# Altium schematic sheet STM32F1.SchDoc
size A3; Organization: Altium Limited; Address1: L3, 12a Rodborough Rd; Address2: Frenchs Forest; Address3: NSW; Address4: Australia 2086
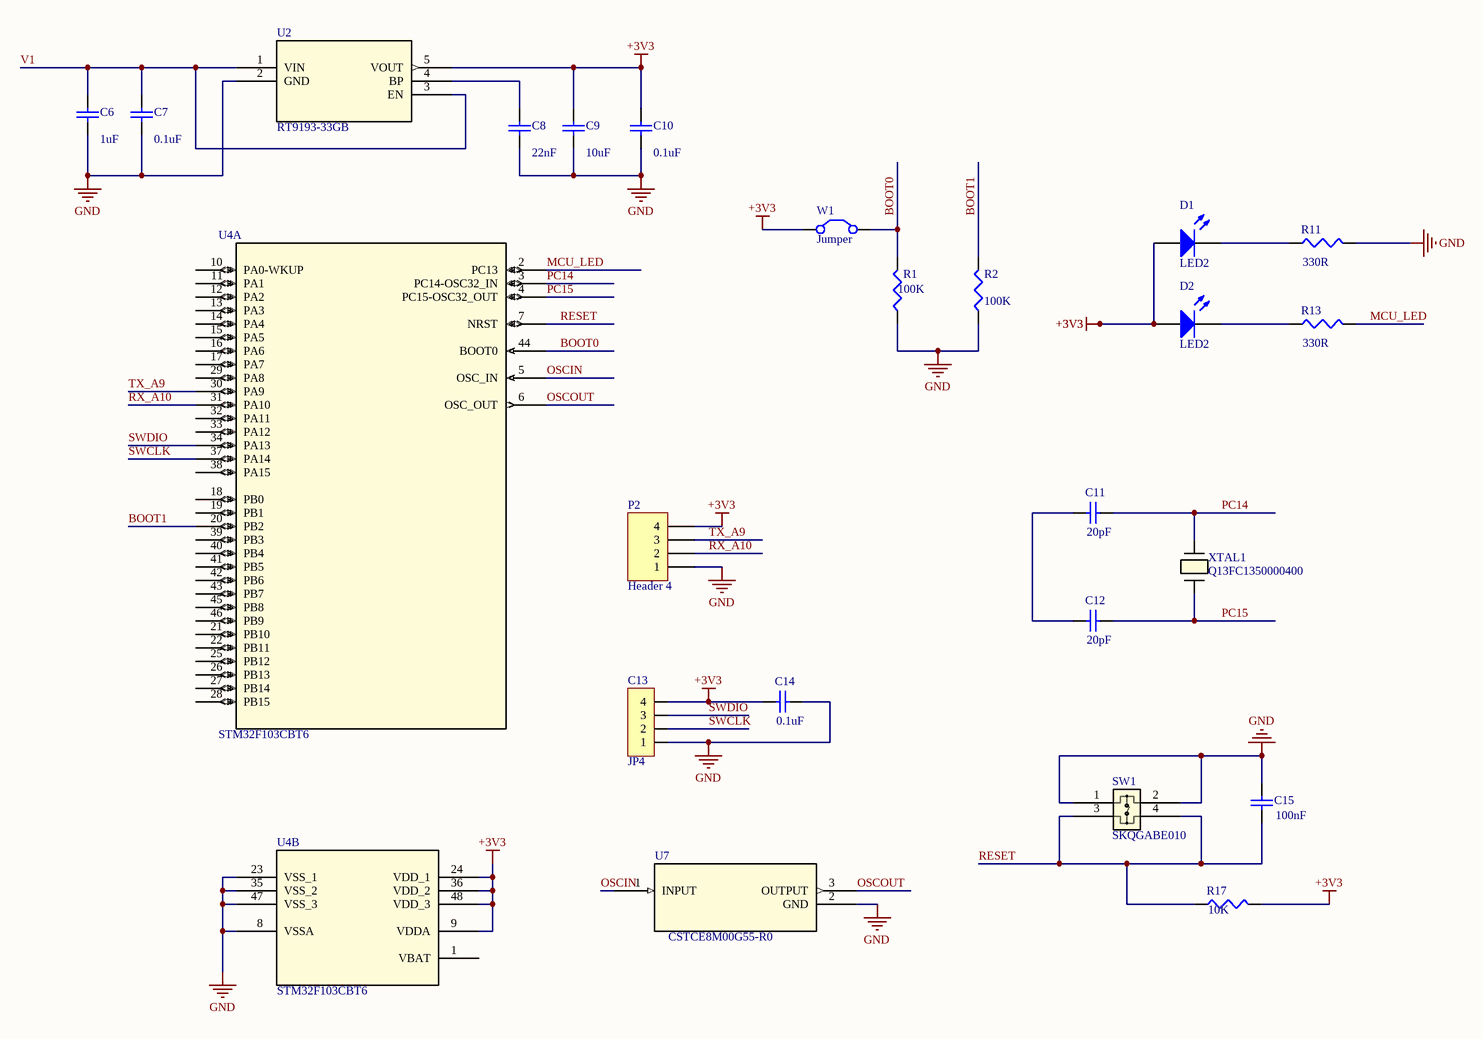
[diagram p0: STM32F1.SchDoc]

## Parts
C6  1uF  [RAD-0.3]
C7  0.1uF  [RAD-0.3]
C8  22nF  [RAD-0.3]
C9  10uF  [RAD-0.3]
C10  0.1uF  [RAD-0.3]
C11  20pF  [RAD-0.3]
C12  20pF  [RAD-0.3]
C13  JP4  [JP4-C1T]
C14  0.1uF  [RAD-0.3]
C15  100nF  [RAD-0.3]
D1  LED2  [3.2X1.6X1.1]
D2  LED2  [3.2X1.6X1.1]
P2  Header 4  [HDR1X4]
R1  100K  [J1-0603]
R2  100K  [J1-0603]
R11  330R  [J1-0603]
R13  330R  [J1-0603]
R17  10K  [J1-0603]
SW1  SKQGABE010  [SKQGABE010_ALPS]
U2  RT9193-33GB  [SOT-23-5_RIT]
U4  STM32F103CBT6  [LQFP48-7x7mm]  (parts A,B of 2)
U7  CSTCE8M00G55-R0  [CSTCE8M00G55-R0_MUR]
W1  Jumper  [RAD-0.2]
XTAL1  Q13FC1350000400  [XTAL_FC-135_EPS]

## Nets
+3V3: C9.2 C10.2 C13.4 C14.1 D1.1(A) D2.1(A) P2.4 R17.2 U2.5(VOUT) U4.9(VDDA) U4.24(VDD_1) U4.36(VDD_2) U4.48(VDD_3) W1.1(C1)
GND: C6.1 C7.1 C8.1 C9.1 C10.1 C13.1 C14.2 C15.1 P2.1 R1.1 R2.1 R11.2 SW1.1 SW1.2 U2.2(GND) U4.8(VSSA) U4.23(VSS_1) U4.35(VSS_2) U4.47(VSS_3) U7.2(GND)
BOOT0: R1.2 U4.44(BOOT0) W1.2(C2)
BOOT1: R2.2 U4.20(PB2)
MCU_LED: R13.2 U4.2(PC13)
OSCIN: U4.5(OSC_IN) U7.1(INPUT)
OSCOUT: U4.6(OSC_OUT) U7.3(OUTPUT)
PC14: C11.2 U4.3(PC14-OSC32_IN) XTAL1.2
PC15: C12.2 U4.4(PC15-OSC32_OUT) XTAL1.1
RESET: C15.2 R17.1 SW1.3 SW1.4 U4.7(NRST)
RX_A10: P2.2 U4.31(PA10)
SWCLK: C13.2 U4.37(PA14)
SWDIO: C13.3 U4.34(PA13)
TX_A9: P2.3 U4.30(PA9)
V1: C6.2 C7.2 U2.1(VIN) U2.3(EN)
NetC8_2: C8.2 U2.4(BP)
NetC11_1: C11.1 C12.1
NetD1_2: D1.2(K) R11.1
NetD2_2: D2.2(K) R13.1

Not connected (* = marked no-connect by the designer): U4 1(VBAT) 10(PA0-WKUP) 11(PA1) 12(PA2) 13(PA3) 14(PA4) 15(PA5) 16(PA6) 17(PA7) 18(PB0) 19(PB1) 21(PB10) 22(PB11) 25(PB12) 26(PB13) 27(PB14) 28(PB15) 29(PA8) 32(PA11) 33(PA12) 38(PA15) 39(PB3) 40(PB4) 41(PB5) 42(PB6) 43(PB7) 45(PB8) 46(PB9)

## Notes on the sheet
- Title
- Size:
- Date:
- A3
- Number:
- Time:
- Revision:
- Sheet
- of
- File:

## Library data of the parts
C6-C12 C14 C15 = Cap: Capacitor; Published: 8-Jun-2000; LatestRevisionDate: 17-Jul-2002; LatestRevisionNote: Re-released for DXP Platform.; PackageReference: RAD-0.3; Publisher: Altium Limited; PackageDescription: Radial Cap, Thru-Hole; 2 Leads; 0.3 in Pin Spacing
  C6: Value: 1uF
  C7 C10 C14: Value: 0.1uF
  C8: Value: 22nF
  C9: Value: 10uF
  C11 C12: Value: 20pF
  C15: Value: 100nF
C13 = JP4: WR-PHD 2.54 mm Angled Socket Header; Manufacturer: W¨¹rth Elektronik eiSos GmbH; partNo: 613004143121; ComponentLink1 Description: Manufacturer; ComponentLink2 Description: Datasheet; NoPins: 04; Created Date: 29 March 2013; ComponentLink1URL: http://www.we-online.com; ComponentLink2URL: http://katalog.we-online.de/em/datasheet/6130xx143121.pdf; Created by: Karrer Zheng
D1 D2 = LED2: Typical RED, GREEN, YELLOW, AMBER GaAs LED; Published: 8-Jun-2000; LatestRevisionDate: 17-Jul-2002; LatestRevisionNote: Re-released for DXP Platform.; PackageVersion: Feb-2002; PackageReference: 3.2X1.6X1.1; Publisher: Altium Limited; PackageDescription: SM LED; 2 Flat Leads
P2 = Header 4: Header, 4-Pin; LatestRevisionDate: 17-Jul-2002; LatestRevisionNote: Re-released for DXP Platform.; Publisher: Altium Limited
R1 R2 R11 R13 R17 = Res3: Resistor; Published: 8-Jun-2000; LatestRevisionDate: 29-May-2009; LatestRevisionNote: IPC-7351 Footprint Added.; PackageReference: J1-0603; Publisher: Altium Limited; PackageDescription: Chip Resistor
  R1 R2: Value: 100K
  R11 R13: Value: 330R
  R17: Value: 10K
SW1 = SKQGABE010: No Description Available; Mfr_Name: Alps Electric; RefDes: RefDes; Type: Type
U2 = RT9193-33GB: No Description Available; Mfr_Name: Richtek Technology; RefDes: RefDes; Type: Type
U4 = STM32F103CBT6: No Description Available; Mfr_Name: STMicroelectronics; RefDes: RefDes; Type: Type
U7 = CSTCE8M00G55-R0: No Description Available; Mfr_Name: Murata; RefDes: RefDes; Type: Type
W1 = Jumper: Jumper Wire; Published: 24-Mar-1999; LatestRevisionDate: 17-Jul-2002; LatestRevisionNote: Re-released for DXP Platform.; PackageReference: RAD-0.2; Publisher: Altium Limited; PackageDescription: Radial Cap, Thru-Hole; 2 Leads; 0.2 in Pin Spacing
XTAL1 = Q13FC1350000400: No Description Available; Mfr_Name: Epson